# Altium schematic sheet [02] - BLOCK DIAGRAM.SchDoc
size A2; DocumentNumber: 2; SheetNumber: 2; SheetTotal: 6; PageSetup: Record=PageOptions|CenterHorizontal=True|CenterVertical=True|PrintScale=0.52|XCorrection=1.00|YCorrection=1.00|PrintKind=1|BorderSize=5000000|LeftOffset=0|BottomOffset=0|Orientation=2|PaperLength=1000|PaperWidth=1000|Scale=100|PaperSource=4|PrintQuality=600|MediaType=1|DitherType=10|PrintScaleMode=1|PaperKind=A4|PaperIndex=9
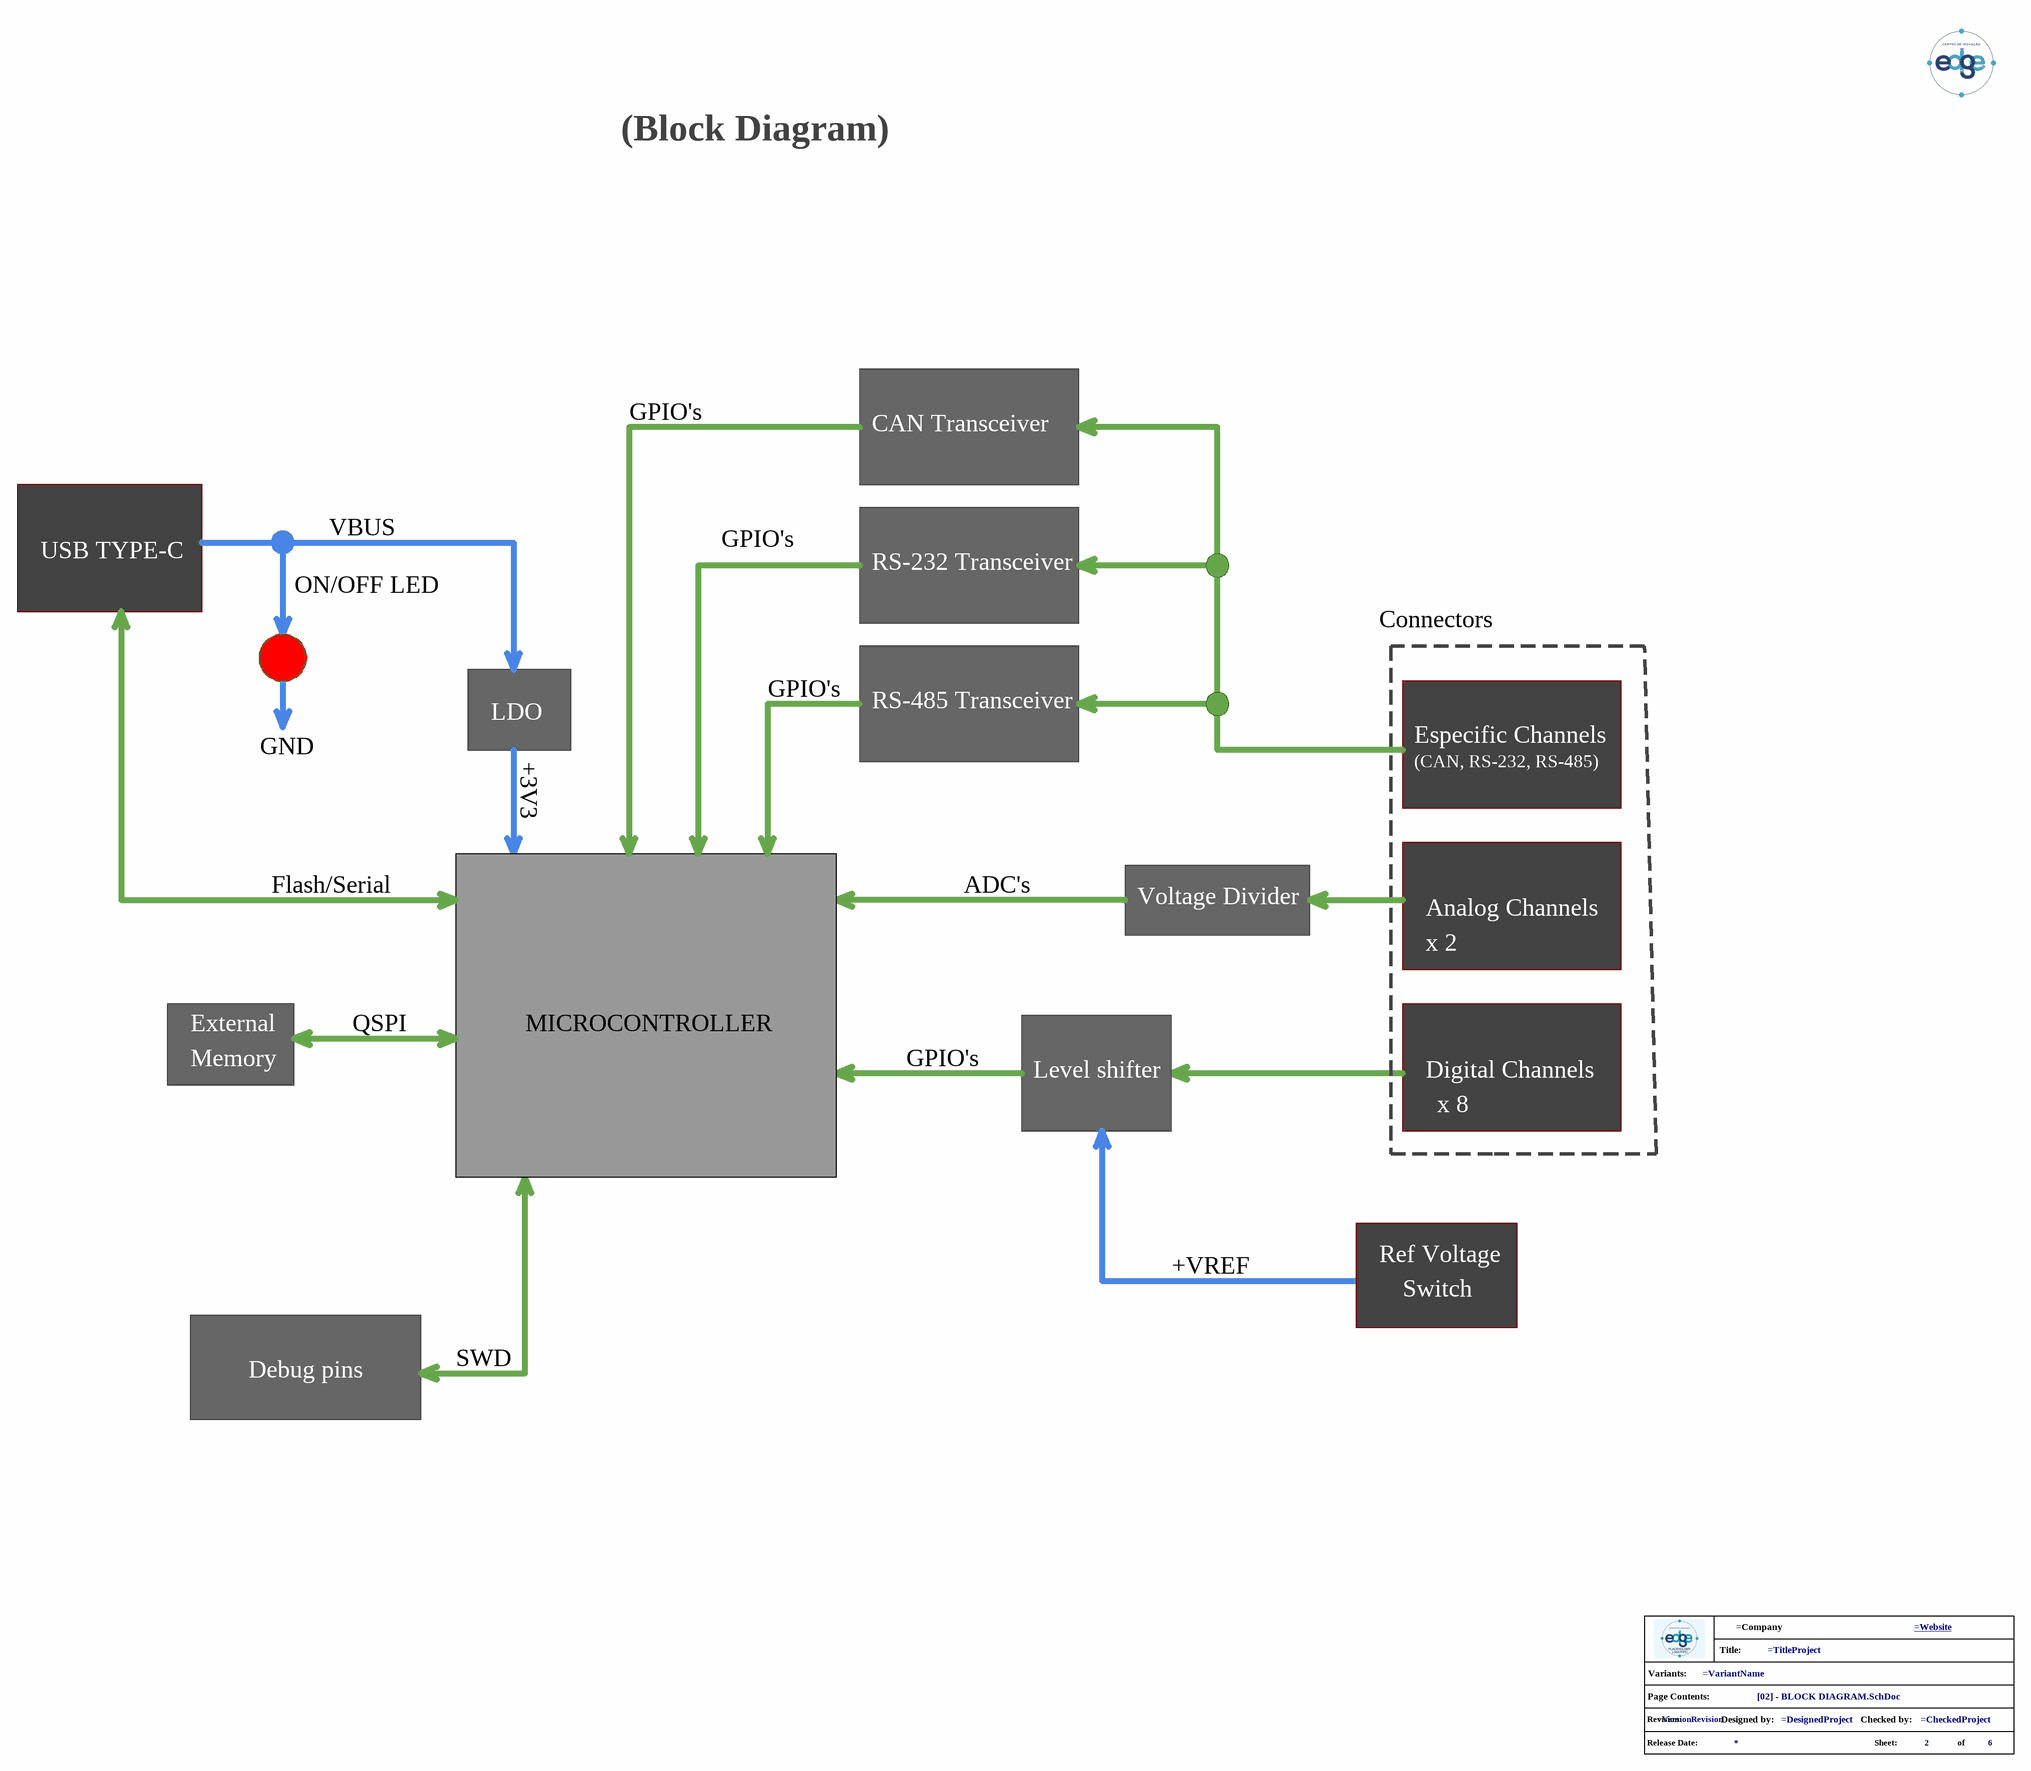
[diagram p0: [02] - BLOCK DIAGRAM.SchDoc]

## Parts
*?  info_project  (value not drawn)  (graphical)

## Notes on the sheet
- (Block Diagram)
- GPIO's
- CAN Transceiver
- VBUS
- USB TYPE-C
- ON/OFF LED
- RS-232 Transceiver
- Connectors
- RS-485 Transceiver
- GND
- LDO
- +3V3
- Especific Channels
- (CAN, RS-232, RS-485)
- Flash/Serial
- ADC's
- Voltage Divider
- Analog Channels
- x 2
- External
- QSPI
- MICROCONTROLLER
- Memory
- Level shifter
- Digital Channels
- x 8
- +VREF
- Ref Voltage
- Switch
- Debug pins
- SWD
- (in symbol info_project) Title:; Variants:; Page Contents:; Revision:; Designed by:; Checked by:; Release Date:; Sheet:; of